# Altium schematic sheet Nixie Board.SchDoc: Nixie Clock Tube- / Front- panel
size A4; DrawnBy: Thorben Zethoff; Revision: 1.0
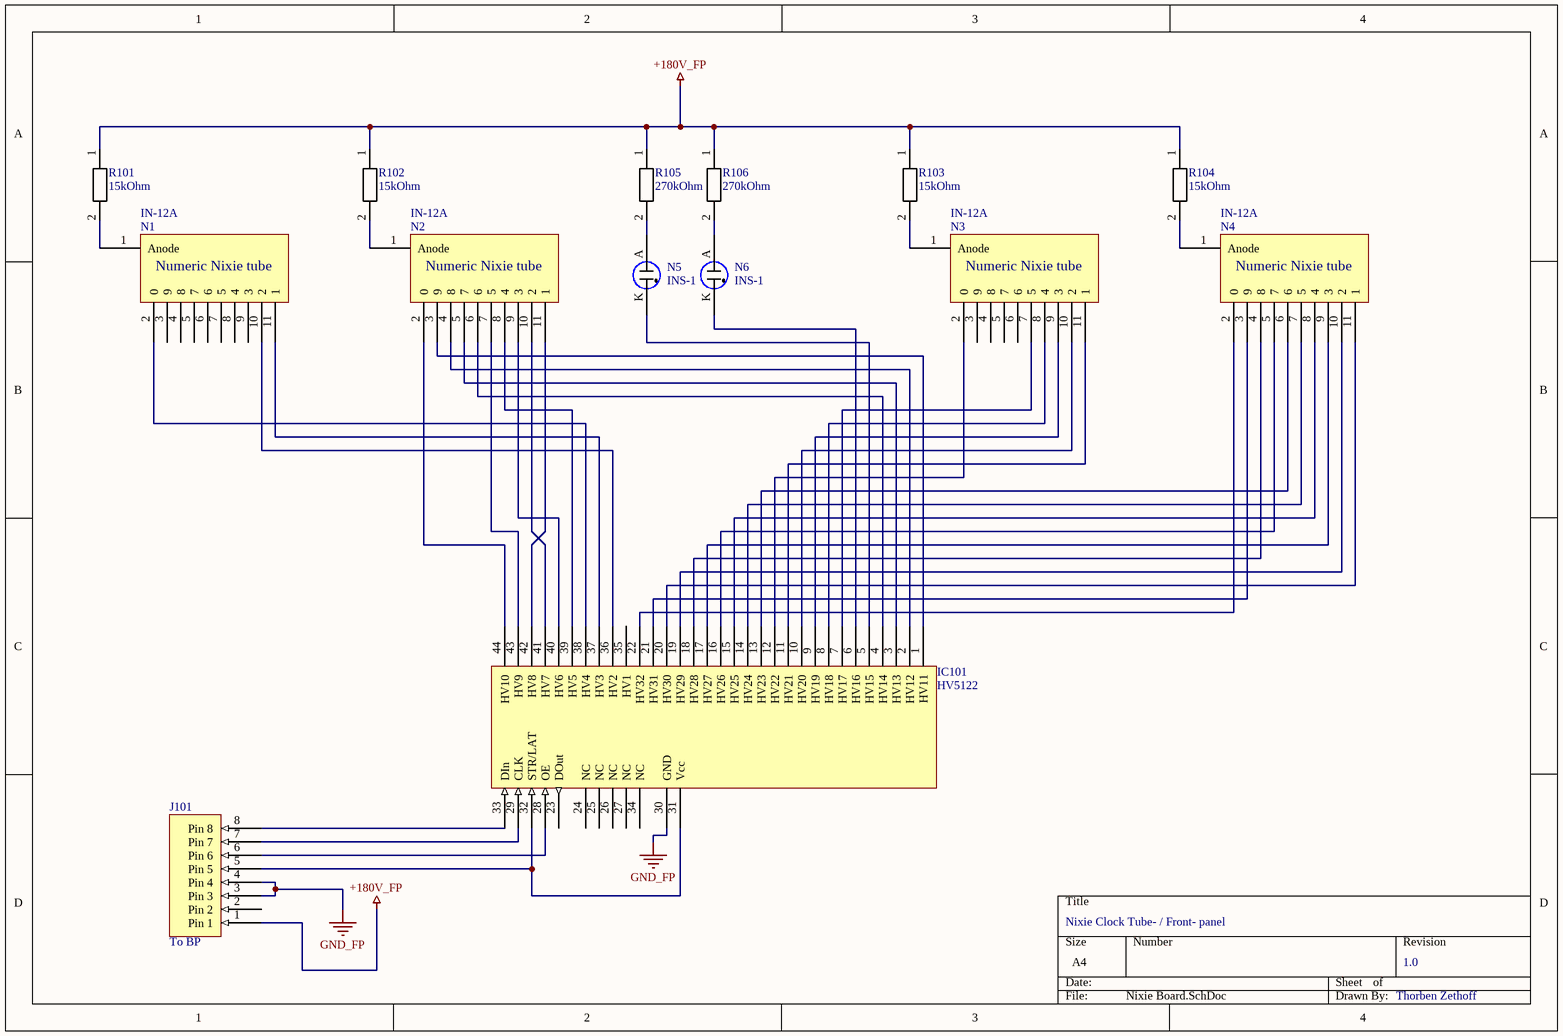
[diagram p0: Nixie Board.SchDoc]

## Parts
IC101  HV5122  [PQFP44]
J101  To BP  [Molex 0528080871]
N1  IN-12A  [IN12-A Nixie]
N2  IN-12A  [IN12-A Nixie]
N3  IN-12A  [IN12-A Nixie]
N4  IN-12A  [IN12-A Nixie]
N5  INS-1  [INS-1]
N6  INS-1  [INS-1]
R101  15kOhm  [1206]
R102  15kOhm  [1206]
R103  15kOhm  [1206]
R104  15kOhm  [1206]
R105  270kOhm  [1206]
R106  270kOhm  [1206]

## Nets
+180V_FP: J101.1(Pin_1) R101.1 R102.1 R103.1 R104.1 R105.1 R106.1
GND_FP: IC101.30(GND) J101.3(Pin_3) J101.4(Pin_4)
NetIC101_1: IC101.1(HV11) N2.3(9)
NetIC101_2: IC101.2(HV12) N2.4(8)
NetIC101_3: IC101.3(HV13) N2.5(7)
NetIC101_4: IC101.4(HV14) N2.6
NetIC101_5: IC101.5(HV15) N5.K
NetIC101_6: IC101.6(HV16) N6.K
NetIC101_7: IC101.7(HV17) N3.7(5)
NetIC101_8: IC101.8(HV18) N3.8(4)
NetIC101_9: IC101.9(HV19) N3.9(3)
NetIC101_10: IC101.10(HV20) N3.10(2)
NetIC101_11: IC101.11(HV21) N3.11(1)
NetIC101_12: IC101.12(HV22) N3.2(0)
NetIC101_13: IC101.13(HV23) N4.6
NetIC101_14: IC101.14(HV24) N4.7(5)
NetIC101_15: IC101.15(HV25) N4.8(4)
NetIC101_16: IC101.16(HV26) N4.5(7)
NetIC101_17: IC101.17(HV27) N4.9(3)
NetIC101_18: IC101.18(HV28) N4.4(8)
NetIC101_19: IC101.19(HV29) N4.10(2)
NetIC101_20: IC101.20(HV30) N4.11(1)
NetIC101_21: IC101.21(HV31) N4.3(9)
NetIC101_22: IC101.22(HV32) N4.2(0)
NetIC101_28: IC101.28(OE) J101.6(Pin_6)
NetIC101_29: IC101.29(CLK) J101.7(Pin_7)
NetIC101_31: IC101.31(Vcc) IC101.32(STR/LAT) J101.5(Pin_5)
NetIC101_33: IC101.33(DIn) J101.8(Pin_8)
NetIC101_36: IC101.36(HV2) N1.10(2)
NetIC101_37: IC101.37(HV3) N1.11(1)
NetIC101_38: IC101.38(HV4) N1.2(0)
NetIC101_39: IC101.39(HV5) N2.8(4)
NetIC101_40: IC101.40(HV6) N2.9(3)
NetIC101_41: IC101.41(HV7) N2.10(2)
NetIC101_42: IC101.42(HV8) N2.11(1)
NetIC101_43: IC101.43(HV9) N2.7(5)
NetIC101_44: IC101.44(HV10) N2.2(0)
NetN1_1: N1.1(Anode) R101.2
NetN2_1: N2.1(Anode) R102.2
NetN3_1: N3.1(Anode) R103.2
NetN4_1: N4.1(Anode) R104.2
NetN5_A: N5.A R105.2
NetN6_A: N6.A R106.2

Not connected (* = marked no-connect by the designer): IC101 23(DOut) 24(NC) 25(NC) 26(NC) 27(NC) 34(NC) 35(HV1); J101 2(Pin_2); N1 3(9) 4(8) 5(7) 6 7(5) 8(4) 9(3); N3 3(9) 4(8) 5(7) 6

## Notes on the sheet
- (in symbol Nixie numeric 0-9) Numeric Nixie tube

## Library data of the parts
IC101 = HV5122: 32bit HV shift register; ComponentLink1Description: Datasheet; ComponentLink1URL: http://ww1.microchip.com/downloads/en/DeviceDoc/20005418B.pdf
J101 = Molex 0528080871: 8 Pin FFC SMD staight
N1-N4 = Nixie numeric 0-9: Nixie tube numeric without decimal point; ComponentLink1Description: Info for IN-12A; ComponentLink1URL: http://www.tube-tester.com/sites/nixie/data/in-12a.htm
N5 N6 = Nixie Dot: Neon dot indicator
R101-R106 = Resistor